# EAGLE design dsky_md_2.2v (EAGLE 6.5.0)
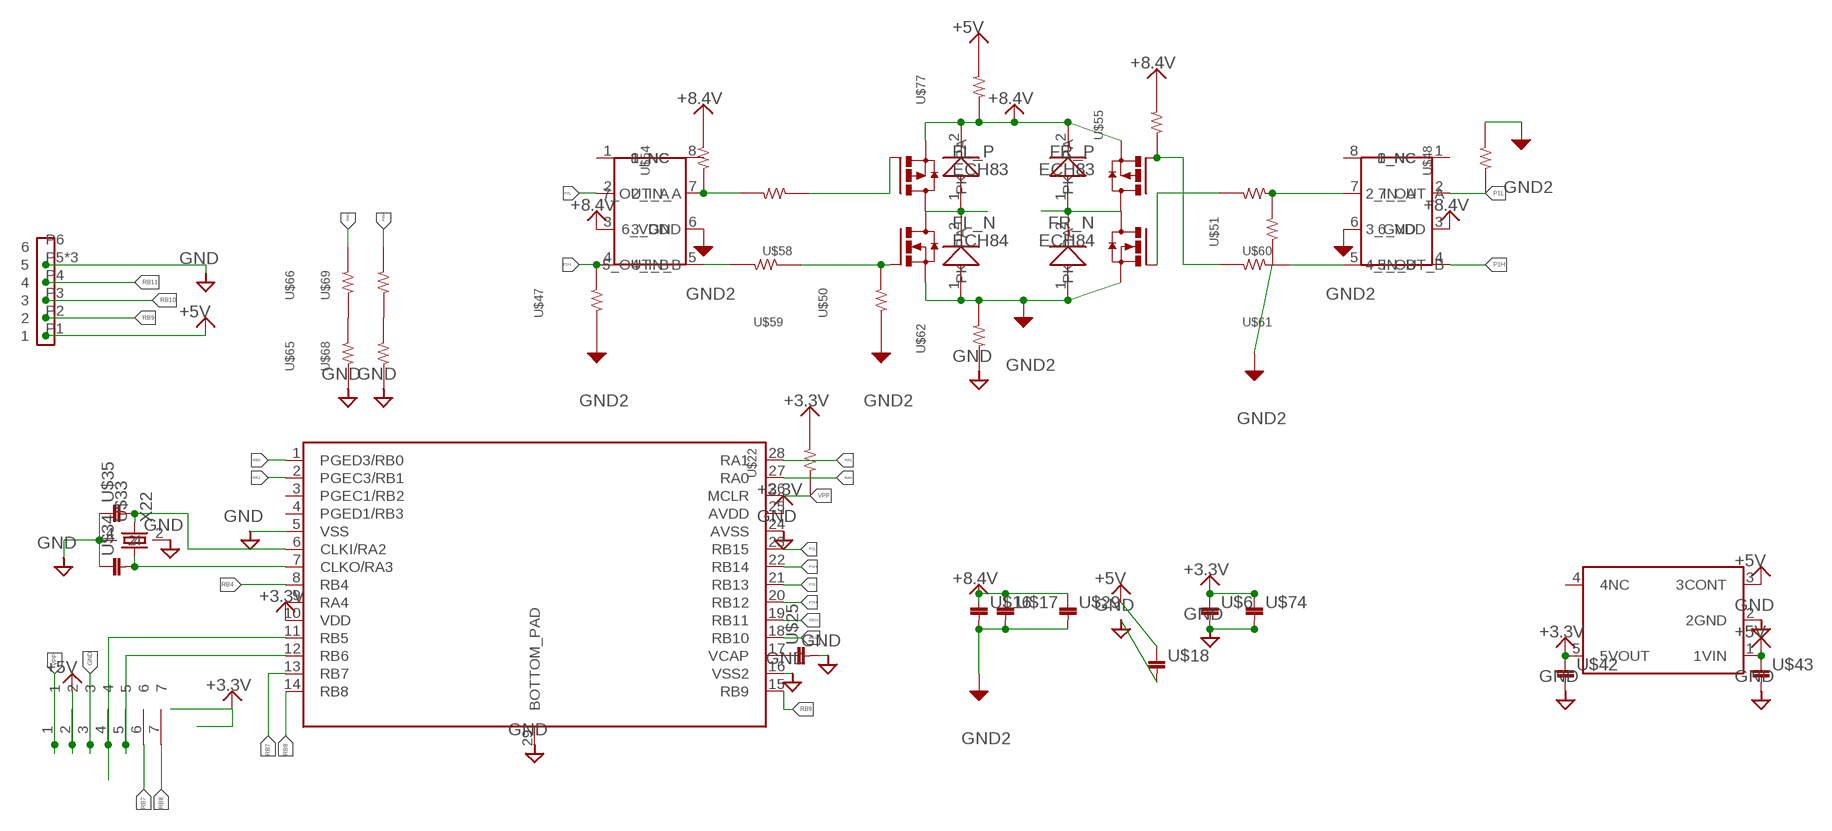
[diagram p0: schematic, sheet 1]

## Parts
FL_N  ECH84  [ECH8]
FL_P  ECH83  [ECH8]
FR_N  ECH84  [ECH8]
FR_P  ECH83  [ECH8]
IC_L  TC1427COA  [SOIC8]
IC_R  TC1427COA  [SOIC8]
U$3  PIN_HEADER_7  [PIN_HEADER_7]
U$5  DSPIC33EP32MC202  [QFN-S28_6X6MC]
U$6  1608  [1608]
U$16  1608  [1608]
U$17  1608  [1608]
U$18  1608  [1608]
U$22  RESISTOR__SMD  [1608]
U$25  1608  [1608]
U$29  2012  [2012]
U$30  TAR5SB  [SSOP5-P-0.95]
U$33  X22  [SMD_X22]
U$34  1608  [1608]
U$35  1608  [1608]
U$42  1608  [1608]
U$43  1608  [1608]
U$44  FH12-6S-0.5  [FPC6]
U$47  RESISTOR__SMD  [1608]
U$48  RESISTOR__SMD  [1608]
U$50  RESISTOR__SMD  [1608]
U$51  RESISTOR__SMD  [1608]
U$54  RESISTOR__SMD  [1608]
U$55  RESISTOR__SMD  [1608]
U$58  RESISTOR__SMD  [1608]
U$59  RESISTOR__SMD  [1608]
U$60  RESISTOR__SMD  [1608]
U$61  RESISTOR__SMD  [1608]
U$62  RESISTOR__SMD  [1608]
U$65  RESISTOR__SMD  [1608]
U$66  RESISTOR__SMD  [1608]
U$68  RESISTOR__SMD  [1608]
U$69  RESISTOR__SMD  [1608]
U$70  SS2040  [SOD-123FL]
U$71  SS2040  [SOD-123FL]
U$72  SS2040  [SOD-123FL]
U$73  SS2040  [SOD-123FL]
U$74  1608  [1608]
U$77  RESISTOR__SMD  [1608]

## Nets
+3.3V: U$5.10(VDD) U$5.25(AVDD) U$6.P$1 U$22.2 U$30.5(5VOUT) U$42.P$1 U$74.P$1
+5V: U$3.2 U$18.P$1 U$30.1(1VIN) U$30.3(3CONT) U$43.P$1 U$44.P1 U$77.2
+8.4V: FL_P.1(S) FL_P.2(S) FL_P.3(S) FR_P.1(S) FR_P.2(S) FR_P.3(S) IC_L.3(3_GND) IC_R.3(3_GND) U$16.P$1 U$17.P$1 U$29.1 U$54.2 U$55.2 U$70.2(PK) U$73.2(PK) U$77.1
GND: U$3.3 U$5.5(VSS) U$5.16(VSS2) U$5.24(AVSS) U$5.29(BOTTOM_PAD) U$6.P$2 U$18.P$2 U$25.P$2 U$30.2(2GND) U$33.2 U$33.4 U$34.P$1 U$35.P$1 U$42.P$2 U$43.P$2 U$44.P5 U$44.P_NC1 U$44.P_NC2 U$62.1 U$65.1 U$68.1 U$74.P$2
GND2: FL_N.1(S) FL_N.2(S) FL_N.3(S) FR_N.1(S) FR_N.2(S) FR_N.3(S) IC_L.6(6_VDD) IC_R.6(6_VDD) U$16.P$2 U$17.P$2 U$29.2 U$47.1 U$48.2 U$50.1 U$51.1 U$62.2 U$71.1(PA) U$72.1(PA)
M_L: FL_N.5(D) FL_N.6(D) FL_N.7(D) FL_N.8(D) FL_P.5(D) FL_P.6(D) FL_P.7(D) FL_P.8(D) U$70.1(PA) U$71.2(PK)
M_R: FR_N.5(D) FR_N.6(D) FR_N.7(D) FR_N.8(D) FR_P.5(D) FR_P.6(D) FR_P.7(D) FR_P.8(D) U$72.2(PK) U$73.1(PA)
N$1: FL_P.4(G) U$58.1
N$2: FL_N.4(G) U$50.2 U$59.1
N$3: IC_L.7(7_OUT_A) U$54.1 U$58.2
N$4: FR_P.4(G) U$55.1 U$61.2
N$5: IC_L.5(5_OUT_B) U$59.2
N$6: IC_R.7(7_OUT_A) U$51.2 U$60.1
N$7: U$5.17(VCAP) U$25.P$1
N$8: U$5.7(CLKO/RA3) U$33.1 U$34.P$2
N$9: IC_R.5(5_OUT_B) U$61.1
N$10: U$3.4 U$5.11(RB5)
N$11: U$3.5 U$5.12(RB6)
N$12: FR_N.4(G) U$60.2
N$13: U$5.6(CLKI/RA2) U$33.3 U$35.P$2
N$14: U$65.2 U$66.1
N$16: U$68.2 U$69.1
P1H: IC_R.4(4_IN_B) U$5.22(RB14)
P1L: IC_R.2(2_IN_A) U$5.23(RB15) U$48.1
P2H: IC_L.4(4_IN_B) U$5.20(RB12) U$47.2
P2L: IC_L.2(2_IN_A) U$5.21(RB13)
RA0: U$5.27(RA0) U$66.2
RA1: U$5.28(RA1)
RB0: U$5.1(PGED3/RB0) U$69.2
RB1: U$5.2(PGEC3/RB1)
RB4: U$5.8(RB4)
RB7: U$3.6 U$5.13(RB7)
RB8: U$3.7 U$5.14(RB8)
RB9: U$5.15(RB9) U$44.P2
RB10: U$5.18(RB10) U$44.P3
RB11: U$5.19(RB11) U$44.P4
VPP: U$3.1 U$5.26(MCLR) U$22.1
Unconnected: IC_L.1(1_NC) IC_L.8(8_NC) IC_R.1(1_NC) IC_R.8(8_NC) U$5.3(PGEC1/RB2) U$5.4(PGED1/RB3) U$5.9(RA4) U$30.4(4NC) U$44.P6

## Library data of the parts
FL_N FR_N = 06_FET:ECH84
FL_P FR_P = 06_FET:ECH83
IC_L IC_R = 04_IC:TC1427COA
U$3 = 08_CONECTOR:PIN_HEADER_7
U$5 = microchip-dspic:DSPIC33EP32MC202
U$6 U$16-U$18 U$25 U$34 U$35 U$42 U$43 U$74 = 02_C:1608
U$22 U$47 U$48 U$50 U$51 U$54 U$55 U$58-U$62 U$65 U$66 U$68 U$69 U$77 = 01_R:RESISTOR__SMD
U$29 = 02_C:2012
U$30 = 04_IC:TAR5SB
U$33 = 09_2_CRYSTAL:X22
U$44 = 08_CONECTOR:FH12-6S-0.5
U$70-U$73 = DIODE:SS2040

## Board
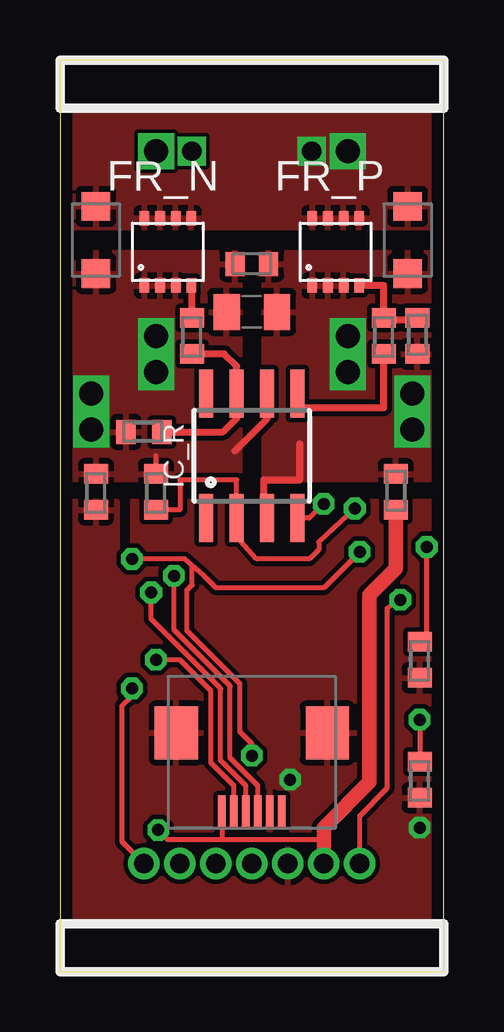
[diagram p1: board, top side]
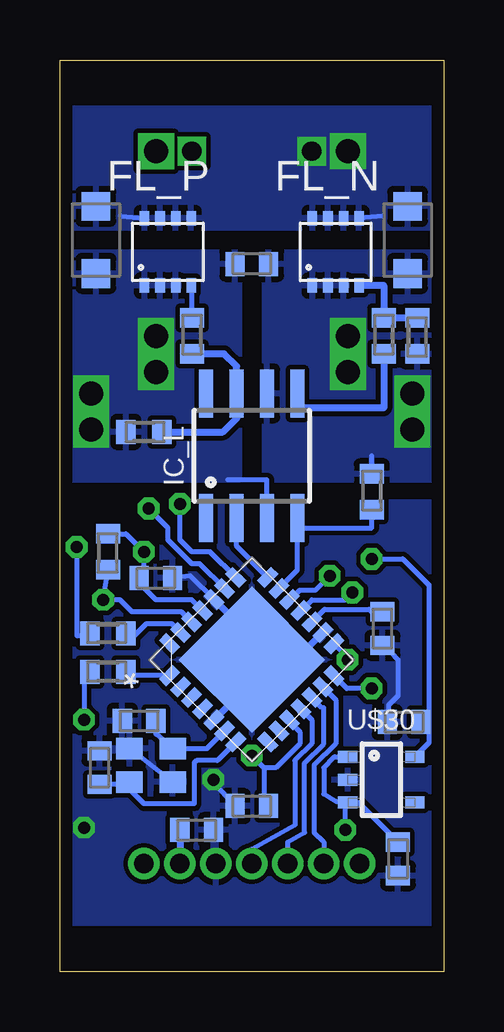
[diagram p2: board, bottom side, seen from below]

Size 16 x 38 mm. Coordinates in mm from the lower left corner, seen from the top.
Outline: 0,0 16,0 16,38 0,38 0,0
Copper layers (1*16): Top 0.035mm / dielectric 1.5mm / Bottom 0.035mm
Design rules "default *": minimum track width 6mil, minimum drill 12mil, track to track 6mil, track to pad 6mil, pad to pad 6mil, via to via 6mil, smd to smd 8mil, copper to edge 20mil, drill to drill 8mil, minimum pad ring 10mil, minimum via ring 8mil, stop-mask expansion 4mil, vias tented up to drill 0mil, thermal gap 10mil

### Footprints (pad centres in the part's own frame; a part is rotated, then mirrored left to right if it is on the bottom)
ECH8 = smd 0.4 x 0.6: 1 -0.975,-1.4; 2 -0.325,-1.4; 3 0.325,-1.4; 4 0.975,-1.4; 5 0.975,1.4; 6 0.325,1.4; 7 -0.325,1.4; 8 -0.975,1.4
SOIC8 = smd 0.6 x 2: 1 -1.905,-2.6; 2 -0.635,-2.6; 3 0.635,-2.6; 4 1.905,-2.6; 5 1.905,2.6; 6 0.635,2.6; 7 -0.635,2.6; 8 -1.905,2.6
PIN_HEADER_7 = drill 0.8: 1 -4.5,0; 2 -3,0; 3 -1.5,0; 4 0,0; 5 1.5,0; 6 3,0; 7 4.5,0
QFN-S28_6X6MC = smd 0.813 x 0.432: 1 -2.896,1.956; 2 -2.896,1.295; 3 -2.896,0.66; 4 -2.896,0; 5 -2.896,-0.66; 6 -2.896,-1.295; 7 -2.896,-1.956; 15 2.896,-1.956; 16 2.896,-1.295; 17 2.896,-0.66; 18 2.896,0; 19 2.896,0.66; 20 2.896,1.295; 21 2.896,1.956 | smd 0.432 x 0.813: 8 -1.956,-2.896; 9 -1.295,-2.896; 10 -0.66,-2.896; 11 0,-2.896; 12 0.66,-2.896; 13 1.295,-2.896; 14 1.956,-2.896; 22 1.956,2.896; 23 1.295,2.896; 24 0.66,2.896; 25 0,2.896; 26 -0.66,2.896; 27 -1.295,2.896; 28 -1.956,2.896 | smd 4.318 x 4.318: 29 0,0
1608 = smd 0.8 x 1: P$1 -0.7,0; P$2 0.7,0
1608' = smd 0.8 x 1: 1 -0.75,0; 2 0.75,0
2012 = smd 1.1 x 1.5: 1 -1.05,0; 2 1.05,0
SSOP5-P-0.95 = smd 0.5 x 0.8: 1 -0.95,-1.4; 2 0,-1.4; 3 0.95,-1.4; 4 0.95,1.4; 5 -0.95,1.4
SMD_X22 = smd 1.1 x 0.9: 1 -0.9,-0.7; 2 0.9,-0.7; 3 0.9,0.7; 4 -0.9,0.7
FPC6 = smd 0.3 x 1.3: P1 -1.25,0; P2 -0.75,0; P3 -0.25,0; P4 0.25,0; P5 0.75,0; P6 1.25,0 | smd 1.8 x 2.2: P_NC1 3.15,3.25; P_NC2 -3.15,3.25
SOD-123FL = smd 1.2 x 1.2: 1 -1.4,0; 2 1.4,0

### Placement (x,y rotation side)
FL_N  4.5,30 0 bottom
FL_P  11.5,30 0 bottom
FR_N  4.5,30 0 top
FR_P  11.5,30 0 top
IC_L  8,21.5 0 bottom
IC_R  8,21.5 0 top
U$3  8,4.5 180 top
U$5  8,13 45 bottom
U$6  12,16.4 0 bottom
U$16  8,29.5 180 top
U$17  8,29.5 0 bottom
U$18  10.3,5.9 0 bottom
U$22  [1608']  14,17.5 90 bottom
U$25  2.55,14.3 270 bottom
U$29  8,27.5 180 top
U$30  2.6,8 270 bottom
U$33  12.2,8.6 0 bottom
U$34  14.35,8.5 270 bottom
U$35  12.7,10.45 0 bottom
U$42  1.65,10.4 180 bottom
U$43  1.9,4.7 270 bottom
U$44  8,6.7 0 top
U$47  [1608']  3,20 270 bottom
U$48  [1608']  4,20 90 top
U$50  [1608']  1.1,26.5 90 bottom
U$51  [1608']  3.5,22.5 0 top
U$54  [1608']  12.5,22.5 180 bottom
U$55  [1608']  14.9,26.5 270 top
U$58  [1608']  10.5,26.5 270 bottom
U$59  [1608']  2.5,26.5 270 bottom
U$60  [1608']  5.5,26.5 90 top
U$61  [1608']  13.5,26.5 90 top
U$62  [1608']  1.5,20 90 top
U$65  [1608']  15,13 90 top
U$66  [1608']  14,14.1 0 bottom
U$68  [1608']  15,8 90 top
U$69  [1608']  14,12.5 0 bottom
U$70  14.5,30.5 270 bottom
U$71  1.5,30.5 90 bottom
U$72  1.5,30.5 90 top
U$73  14.5,30.5 270 top
U$74  8,6.9 180 bottom
U$77  [1608']  14,20 270 top

### Tracks (layer width: path | path; a pad name or v marks a point on that pad's centre or on a via)
+3.3V  (via drill 0.5)
  Top 0.2: v12.5,17.5 11,16 6.5,16 6,16.5 5.51,16.93 | 5.51,16.93 5.2,17.2 v3,17.2 | v8,9 8,9.5 7.5,10 7.5,12 5.3,14.2 5.3,15.9 5.51,16.11 5.51,16.93
  Bottom 0.2: U$5.25 10.5,15.5 12,15.5 12.7,16.2 U$6.P$1 12.5,16.7 v12.5,17.5 13.25,18.25 U$22.2 | U$5.10 6.42,10.42 6,10 6,9.5 7,8.5 7.5,8.5 | 7.5,8.5 v8,9 | 7.5,8.5 7.5,7.1 U$74.P$1 | 0.6,10.4 0.6,9.55 U$30.5 | 0.6,10.4 0.6,16.1 1.7,17.2 v3,17.2 | U$42.P$1 0.6,10.4
+5V  (via drill 0.5)
  Top 0.2: U$44.P1 6.75,5.5 | 11,5.5 6.75,5.5 | 6.75,5.5 4.5,5.5 v4.1,5.9
  Top 0.6: U$3.2 11,5.5 11,6 12.9,7.9 12.9,15.7 14,16.8 U$77.2
  Bottom 0.2: v4.1,5.9 4.1,6.95 U$30.3 | 4.35,8.95 U$30.1 4.55,8.95 5,8.5 5,7.4 4.5,7.1 3.95,7.1 U$30.3 | U$30.3 3.55,7.05 U$43.P$1
  Bottom 0.3: U$18.P$1 U$3.2
+8.4V  (via drill 1)
  Top 0.3: IC_R.3 8.5,18.9 8.5,20.5 10,20.5 10,22
  Bottom 0.2: IC_L.3 7.37,20.5 9,20.5
  other vias: 12,26.5 12,25 14.7,22.6 14.7,24.1
  pour Bottom (isolate 0.2): 8.5,30 16,30 16,20.5 8.5,20.5
  pour Top (isolate 0.2): 8.5,30 16,30 16,20.5 8.5,20.5
GND  (via drill 0.5)
  Top 0.2: v9.6,8 9.8,8.3
  Bottom 0.2: U$5.24 10.57,16.5 U$6.P$2 | U$25.P$2 2.25,13.3 2.2,13.3 1.9,13 1.9,11.5 2.3,11.1 2.3,10.45 U$42.P$2 | U$74.P$2 9.4,7.7 v9.6,8 | U$33.2 U$33.4
  Bottom 0.3: U$5.5 8,12.07 U$5.29 | U$5.24 8,13.93 U$5.29 | U$5.16 6.17,13 U$5.29
  other vias: 15,6
  pour Top (isolate 0.2): 0,2 16,2 16,19.6 3,19.6 3,16.8 2.4,16.8 2.4,19.6 0,19.6
  pour Bottom (isolate 0.2): 0,2 16,2 16,19.6 0,19.6
GND2  (via drill 1)
  Top 0.2: U$48.2 4,21.5
  Top 0.3: IC_R.6 8.63,23.04 7.3,21.7
  Bottom 0.2: U$47.1 3,21.5
  other vias: 4,26.5 4,25 1.3,22.6 1.3,24.1
  pour Bottom (isolate 0.2): 0,30 7.5,30 7.5,20.5 0,20.5
  pour Top (isolate 0.2): 0,30 7.5,30 7.5,20.5 0,20.5
M_L  (via drill 0.8, 1)
  Bottom 0.2: 2.52,31.5 FL_N.5 | 13.47,31.5 FL_P.8
  other vias: 5.5,34.2 4,34.2
  pour Bottom (isolate 0.2): 0,36 16,36 16,31 0,31
M_R  (via drill 0.8, 1)
  other vias: 10.5,34.2 12,34.2
  pour Top: 0,36 16,36 16,31 0,31
N$1
  Bottom 0.2: U$58.1 10.5,28.57 FL_P.4
N$2
  Bottom 0.3: U$50.2 U$59.1 2.5,28.6 FL_N.4
N$3
  Bottom 0.3: U$58.2 9.15,25.75 8.63,25.23 IC_L.7 8.6,24.07 8.6,23.1 9.2,22.5 U$54.1
N$4
  Top 0.3: FR_P.4 13.5,28.6 U$61.2 14,27.15 14.9,27.15 U$55.1
N$5
  Bottom 0.3: U$59.2 2.5,23.5 6,23.5 6,24.1 IC_L.5
N$6
  Top 0.3: U$60.1 6.85,25.75 7.37,25.23 IC_R.7 7.4,24.07 7.4,23.1 6.8,22.5 U$51.2
N$7
  Bottom 0.2: U$5.17 4.97,15.1 3.1,15.1 3,15 U$25.P$1
N$8
  Bottom 0.2: U$34.P$2 13.2,7.8 U$33.1 13.05,7.55 12.5,7 10.4,7 10.4,8.7 10.3,8.8 9.43,8.8 U$5.7
N$9
  Top 0.3: IC_R.5 9.9,23.59 10,23.5 13.5,23.5 U$61.1
N$10
  Bottom 0.2: U$5.11 5.5,10.5 5.5,9.5 6.2,8.8 6.2,6.1 8,5.1 U$3.4
N$11
  Bottom 0.2: U$3.5 6.5,5.4 5.8,5.8 5.8,8.7 5,9.5 5,11 5.07,11 U$5.12
N$12
  Top 0.3: U$60.2 5.5,28.6 FR_N.4
N$13
  Bottom 0.2: U$35.P$2 12,9.9 U$33.3 9.87,9.3 U$5.6
N$14  (via drill 0.5)
  Top 0.2: U$65.2 15.3,14.05 v15.3,17.7
  Bottom 0.2: v15.3,17.7 15.3,14 U$66.1
N$16  (via drill 0.5)
  Top 0.2: v15,10.5 U$68.2
  Bottom 0.2: U$69.1 15,12.25 v15,10.5
P1H  (via drill 0.5)
  Top 0.2: v11,19.5 10.4,18.9 IC_R.4
  Bottom 0.2: U$5.22 9.73,17.5 10.5,17.5 11,18 v11,19.5
P1L  (via drill 0.5)
  Top 0.2: U$48.1 5,19.25 5,20.5 7.37,20.5 IC_R.2 7.37,18.14 8.2,17.2 10.4,17.2 10.8,17.6 10.8,17.9 v12.3,19.3
  Bottom 0.2: v12.3,19.3 11.5,18.5 11.5,18 10.5,17 10.17,17 U$5.23
P2H
  Bottom 0.2: U$47.2 3,18.5 6.09,18.5 IC_L.4 6.09,16.74 U$5.20
P2L
  Bottom 0.2: U$5.21 8.63,17.73 IC_L.2
RA0
  Bottom 0.2: U$5.27 11.33,14.5 12.4,14.5 12.9,14 U$66.2
RB0
  Bottom 0.2: U$5.1 13.25,12.34 U$69.2
RB7
  Bottom 0.2: U$5.13 4.5,11.33 4.5,9.5 5.4,8.6 5.4,5.8 5,5.4 U$3.6
RB8  (via drill 0.5)
  Top 0.2: U$3.7 2.6,5.4 2.6,11.1 3,11.5 v3,11.8
  Bottom 0.2: v3,11.8 4.03,11.8 U$5.14
RB9  (via drill 0.5)
  Top 0.2: U$44.P2 7.25,7.75 6.3,8.7 6.3,11.7 5,13 v4,13
  Bottom 0.2: v4,13 4,13.1 U$5.15
RB10  (via drill 0.5)
  Top 0.2: U$44.P3 7.75,7.75 6.7,8.8 6.7,11.8 3.8,14.7 v3.8,15.8
  Bottom 0.2: U$5.18 5.5,15.5 4.1,15.5 v3.8,15.8
RB11  (via drill 0.5)
  Top 0.2: U$44.P4 8.25,7.75 7.1,8.9 7.1,11.9 4.75,14.25 v4.75,16.5
  Bottom 0.2: U$5.19 6.39,15.51 6,15.9 5.35,15.9 v4.75,16.5
VPP  (via drill 0.5)
  Top 0.2: U$3.1 12.5,6.5 13.65,7.65 13.65,15.15 v14.2,15.5
  Bottom 0.2: U$22.1 v14.2,15.5 13.5,15.5 13,15 10.93,15 U$5.26